# EAGLE design Display-Board_Rack-PDU_2.0 (EAGLE 9.2.1)
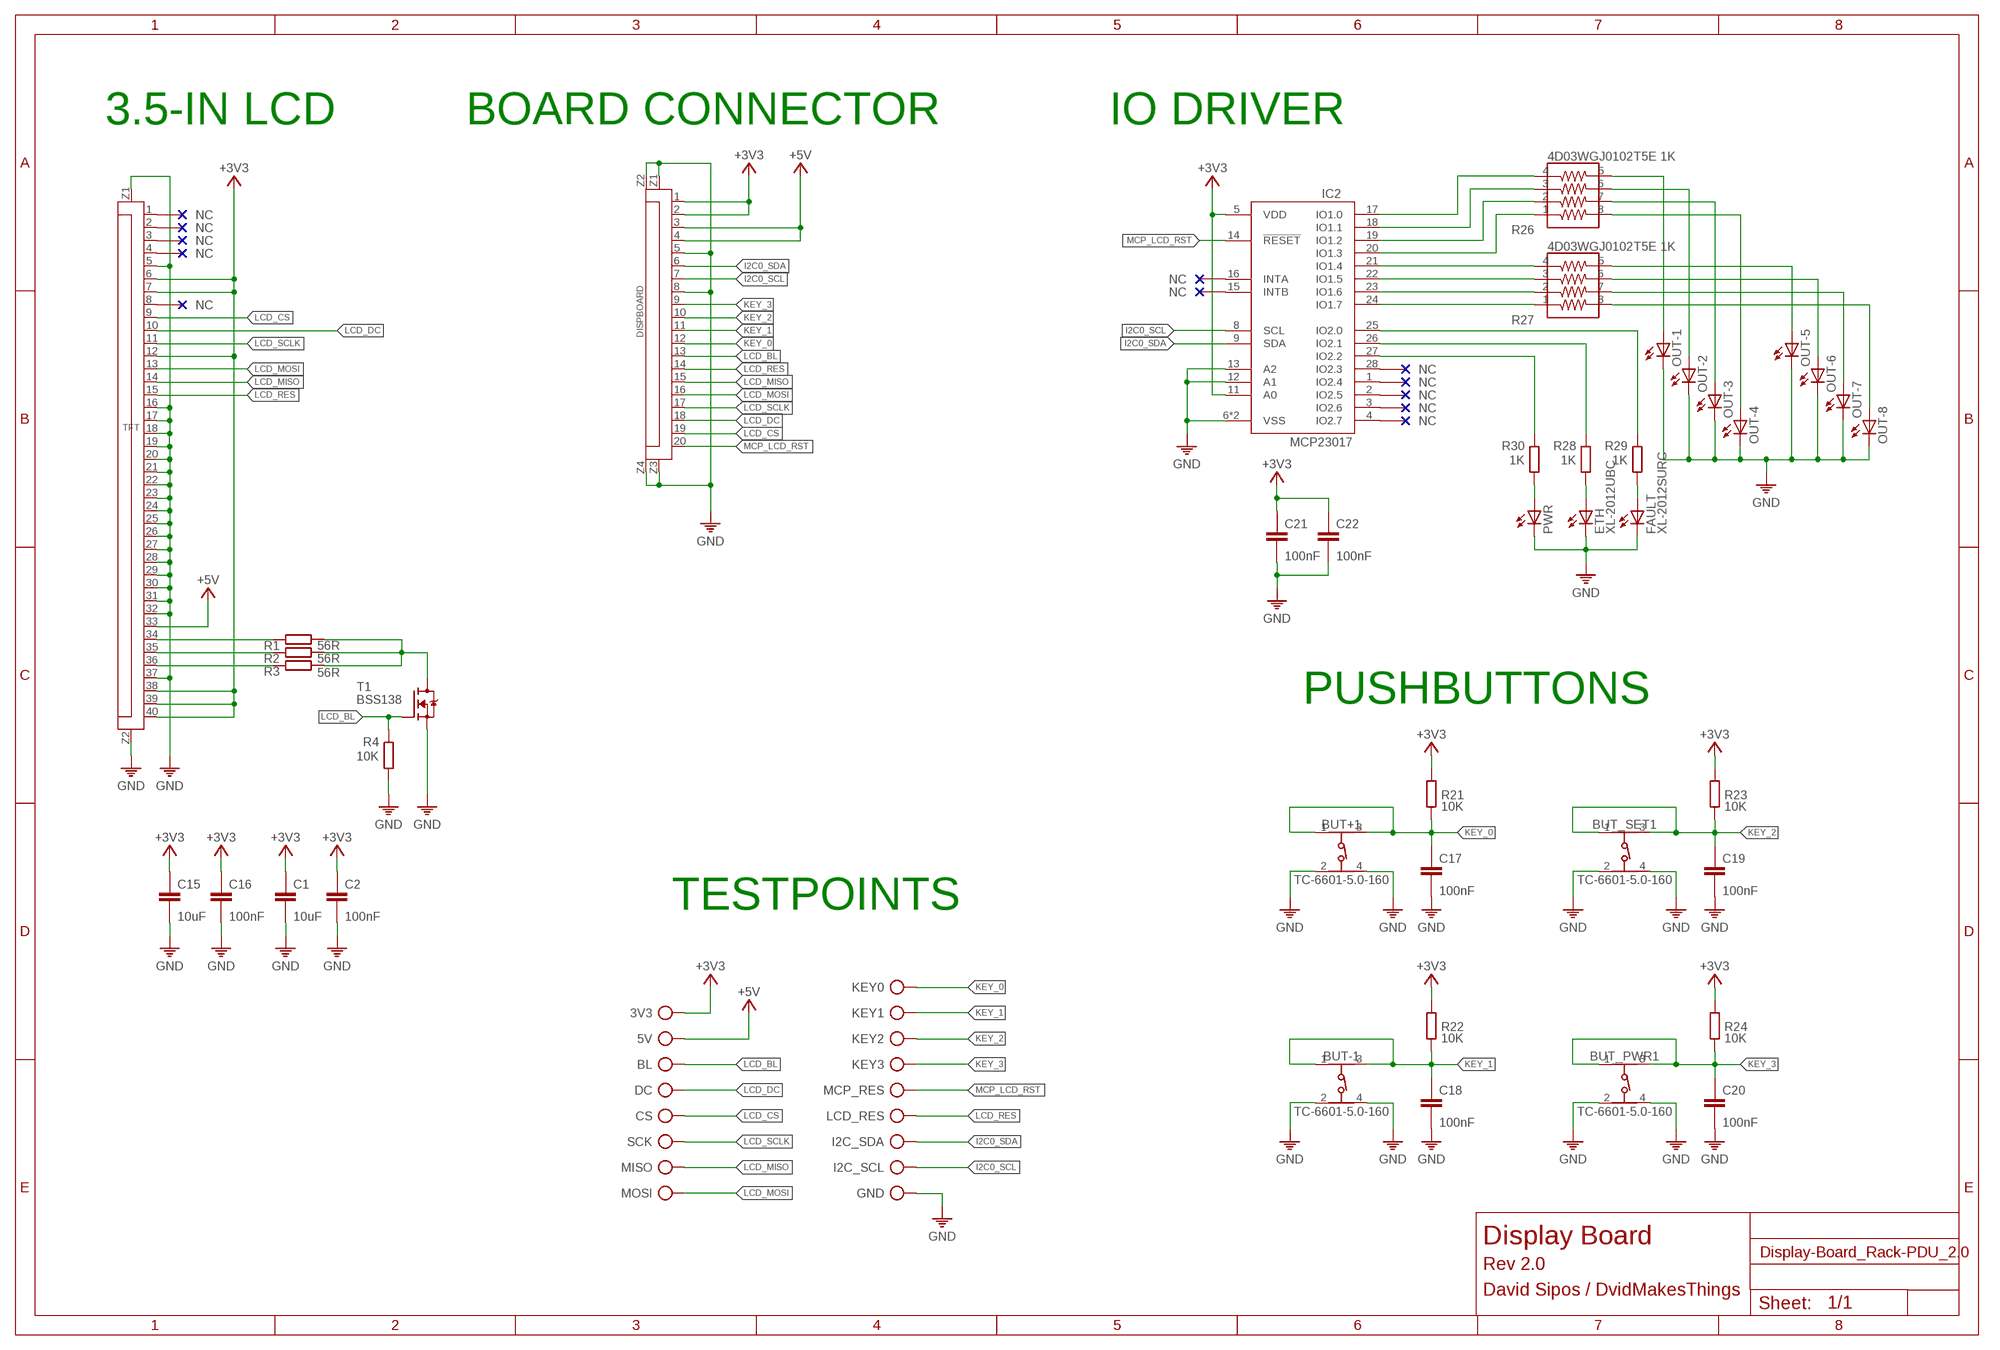
[diagram p0: schematic, sheet 1]

## Parts
3V3  TP  [TP]
5V  TP  [TP]
BL  TP  [TP]
BUT+1  TC-6601-5.0-160  430182043816  [430182043816]
BUT-1  TC-6601-5.0-160  430182043816  [430182043816]
BUT_PWR1  TC-6601-5.0-160  430182043816  [430182043816]
BUT_SET1  TC-6601-5.0-160  430182043816  [430182043816]
C1  10uF  C-0402  [C0402]
C2  100nF  C-0402  [C0402]
C15  10uF  C-0402  [C0402]
C16  100nF  C-0402  [C0402]
C17  100nF  C-0402  [C0402]
C18  100nF  C-0402  [C0402]
C19  100nF  C-0402  [C0402]
C20  100nF  C-0402  [C0402]
C21  100nF  C-0402  [C0402]
C22  100nF  C-0402  [C0402]
CS  TP  [TP]
DC  TP  [TP]
DISPBOARD  FPC20-H  [FPC20]
ETH  XL-2012UBC  LEDCHIP-LED0805  [CHIP-LED0805]
FAULT  XL-2012SURC  LEDCHIP-LED0805  [CHIP-LED0805]
GND  TP  [TP]
I2C_SCL  TP  [TP]
I2C_SDA  TP  [TP]
IC2  MCP23017-E/ML  [QFN28[6X6]ML]
KEY0  TP  [TP]
KEY1  TP  [TP]
KEY2  TP  [TP]
KEY3  TP  [TP]
LCD_RES  TP  [TP]
MCP_RES  TP  [TP]
MISO  TP  [TP]
MOSI  TP  [TP]
OUT-1  LEDCHIP-LED0805  [CHIP-LED0805]
OUT-2  LEDCHIP-LED0805  [CHIP-LED0805]
OUT-3  LEDCHIP-LED0805  [CHIP-LED0805]
OUT-4  LEDCHIP-LED0805  [CHIP-LED0805]
OUT-5  LEDCHIP-LED0805  [CHIP-LED0805]
OUT-6  LEDCHIP-LED0805  [CHIP-LED0805]
OUT-7  LEDCHIP-LED0805  [CHIP-LED0805]
OUT-8  LEDCHIP-LED0805  [CHIP-LED0805]
PWR  LEDCHIP-LED0805  [CHIP-LED0805]
R1  56R  R0402  [0402]
R2  56R  R0402  [0402]
R3  56R  R0402  [0402]
R4  10K  R0402  [0402]
R21  10K  R0402  [0402]
R22  10K  R0402  [0402]
R23  10K  R0402  [0402]
R24  10K  R0402  [0402]
R26  4D03WGJ0102T5E 1K  742C083103JP  [742C083103JP]
R27  4D03WGJ0102T5E 1K  742C083103JP  [742C083103JP]
R28  1K  R0402  [0402]
R29  1K  R0402  [0402]
R30  1K  R0402  [0402]
SCK  TP  [TP]
T1  BSS138  [SOT23]
TFT  FPC40-HD  [FPC40_3.5TFT]

## Nets
+3V3: 3V3.TP C1.1 C2.1 C15.1 C16.1 C21.1 C22.1 DISPBOARD.1 DISPBOARD.2 IC2.5(VDD) IC2.11(A0) R21.1 R22.1 R23.1 R24.1 TFT.6 TFT.7 TFT.12 TFT.38 TFT.39 TFT.40
+5V: 5V.TP DISPBOARD.3 DISPBOARD.4 TFT.33
GND: BUT+1.2 BUT+1.4 BUT-1.2 BUT-1.4 BUT_PWR1.2 BUT_PWR1.4 BUT_SET1.2 BUT_SET1.4 C1.2 C2.2 C15.2 C16.2 C17.2 C18.2 C19.2 C20.2 C21.2 C22.2 DISPBOARD.5 DISPBOARD.8 DISPBOARD.Z1 DISPBOARD.Z2 DISPBOARD.Z3 DISPBOARD.Z4 ETH.C FAULT.C GND.TP IC2.6(VSS) IC2.12(A1) IC2.13(A2) IC2.PAD(VSS) OUT-1.C OUT-2.C OUT-3.C OUT-4.C OUT-5.C OUT-6.C OUT-7.C OUT-8.C PWR.C R4.2 T1.2(S) TFT.5 TFT.16 TFT.17 TFT.18 TFT.19 TFT.20 TFT.21 TFT.22 TFT.23 TFT.24 TFT.25 TFT.26 TFT.27 TFT.28 TFT.29 TFT.30 TFT.31 TFT.32 TFT.37 TFT.Z1 TFT.Z2
I2C0_SCL: DISPBOARD.7 I2C_SCL.TP IC2.8(SCL)
I2C0_SDA: DISPBOARD.6 I2C_SDA.TP IC2.9(SDA)
KEY_0: BUT+1.1 BUT+1.3 C17.1 DISPBOARD.12 KEY0.TP R21.2
KEY_1: BUT-1.1 BUT-1.3 C18.1 DISPBOARD.11 KEY1.TP R22.2
KEY_2: BUT_SET1.1 BUT_SET1.3 C19.1 DISPBOARD.10 KEY2.TP R23.2
KEY_3: BUT_PWR1.1 BUT_PWR1.3 C20.1 DISPBOARD.9 KEY3.TP R24.2
LCD_BL: BL.TP DISPBOARD.13 R4.1 T1.1(G)
LCD_CS: CS.TP DISPBOARD.19 TFT.9
LCD_DC: DC.TP DISPBOARD.18 TFT.10
LCD_MISO: DISPBOARD.15 MISO.TP TFT.14
LCD_MOSI: DISPBOARD.16 MOSI.TP TFT.13
LCD_RES: DISPBOARD.14 LCD_RES.TP TFT.15
LCD_SCLK: DISPBOARD.17 SCK.TP TFT.11
MCP_LCD_RST: DISPBOARD.20 IC2.14(!RESET) MCP_RES.TP
N$2: R2.2 TFT.35
N$3: R3.2 TFT.36
N$4: R1.1 R2.1 R3.1 T1.3(D)
N$5: R1.2 TFT.34
N$46: IC2.26(IO2.1) R28.1
N$47: IC2.27(IO2.2) R30.1
N$48: IC2.25(IO2.0) R29.1
N$50: IC2.17(IO1.0) R26.4
N$51: IC2.18(IO1.1) R26.3
N$52: IC2.19(IO1.2) R26.2
N$53: IC2.20(IO1.3) R26.1
N$54: IC2.21(IO1.4) R27.4
N$55: IC2.22(IO1.5) R27.3
N$56: IC2.23(IO1.6) R27.2
N$57: IC2.24(IO1.7) R27.1
N$58: OUT-1.A R26.5
N$59: OUT-2.A R26.6
N$60: OUT-3.A R26.7
N$61: OUT-4.A R26.8
N$62: OUT-5.A R27.5
N$63: OUT-6.A R27.6
N$64: OUT-7.A R27.7
N$65: OUT-8.A R27.8
N$66: FAULT.A R29.2
N$67: ETH.A R28.2
N$68: PWR.A R30.2
Unconnected: IC2.1(IO2.4) IC2.2(IO2.5) IC2.3(IO2.6) IC2.4(IO2.7) IC2.15(INTB) IC2.16(INTA) IC2.28(IO2.3) TFT.1 TFT.2 TFT.3 TFT.4 TFT.8

## Notes on the sheet
- 3.5-IN LCD | BOARD CONNECTOR | IO DRIVER
- PUSHBUTTONS
- TESTPOINTS
- Display Board
- Rev 2.0
- David Sipos / DvidMakesThings

## Library data of the parts
3V3 5V BL CS DC GND I2C_SCL I2C_SDA KEY0 KEY1-KEY3 LCD_RES MCP_RES MISO MOSI SCK = ds_passive:TP
BUT+1 BUT-1 BUT_PWR1 BUT_SET1 = Wurth_Switch_WS-TASV:430182043816: WS-TASV SMT Tact Switch 6x6 mm Material Properties Cover Material : Stainless Steel Properties Actuator Material:LCP Actuator Flammability :UL94 V-0 Rating Actuator Color:Black; Salmon; White Frame Material:LCP Flammability Rating:UL94 V-0 Frame Color:Black Contact Material:Stainless Steel Contact Plating:Silver Terminal Material:Copper Alloy Terminal Plating:Silver VR:12 V (DC) Contact Resistance Initial:100 mΩ Contact Resistance After Life Test:2Ω RISO:100 MΩ Withstanding Voltage:250 V (AC) Washable:No Qty.:4000;5000 Mechanical Properties Electrical Life:400; 550; 1000 Stroke :0.25 mm General Information Operating Temperature:-40 up to +85 °C Washable:No Packaging Properties Packaging:Tape and Reel <https://www.we-online.com/catalog/media/o37470v209%20Family_WS-TASV_6x6mm_SMD_Tact_Switch_4301820xx8xx.jpg> Details see: https://www.we-online.com/catalog/en/TASV_6X6_SMD/ Updated by yingchun,Shan;2020-02-18 2020(C) Würth Elektronik; DATASHEET-URL: https://www.we-online.com/redexpert/spec/430182043816?ae; HEIGHT: 4.3mm; OPERATION-FORCE: 160g; PART-NUMBER: 430182043816; QTY: 1000; VALUE: 430182043816
C1 C2 C15-C22 = ds_passive:C
DISPBOARD = ds_con:FPC20-H
ETH FAULT OUT-1-OUT-8 PWR = led:LED: LED OSRAM: - CHIPLED LG R971, LG N971, LY N971, LG Q971, LY Q971, LO R971, LY R971 LH N974, LH R974 LS Q976, LO Q976, LY Q976 LO Q996 - Hyper CHIPLED LW Q18S LB Q993, LB Q99A, LB R99A - SideLED LS A670, LO A670, LY A670, LG A670, LP A670 LB A673, LV A673, LT A673, LW A673 LH A674 LY A675 LS A676, LA A676, LO A676, LY A676, LW A676 LS A679, LY A679, LG A679 - Hyper Micro SIDELED® LS Y876, LA Y876, LO Y876, LY Y876 LT Y87S - SmartLED LW L88C, LW L88S LB L89C, LB L89S, LG L890 LS L89K, LO L89K, LY L89K LS L896, LA L896, LO L896, LY L896 - TOPLED LS T670, LO T670, LY T670, LG T670, LP T670 LSG T670, LSP T670, LSY T670, LOP T670, LYG T670 LG T671, LOG T671, LSG T671 LB T673, LV T673, LT T673, LW T673 LH T674 LS T676, LA T676, LO T676, LY T676, LB T676, LH T676, LSB T676, LW T676 LB T67C, LV T67C, LT T67C, LS T67K, LO T67K, LY T67K, LW E67C LS E67B, LA E67B, LO E67B, LY E67B, LB E67C, LV E67C, LT E67C LW T67C LS T679, LY T679, LG T679 LS T770, LO T770, LY T770, LG T770, LP T770 LB T773, LV T773, LT T773, LW T773 LH T774 LS E675, LA E675, LY E675, LS T675 LS T776, LA T776, LO T776, LY T776, LB T776 LHGB T686 LT T68C, LB T68C - Hyper Mini TOPLED® LB M676 - Mini TOPLED Santana® LG M470 LS M47K, LO M47K, LY M47K Source: http://www.osram.convergy.de LUXEON: - LUMILED® LXK2-PW12-R00, LXK2-PW12-S00, LXK2-PW14-U00, LXK2-PW14-V00 LXK2-PM12-R00, LXK2-PM12-S00, LXK2-PM14-U00 LXK2-PE12-Q00, LXK2-PE12-R00, LXK2-PE12-S00, LXK2-PE14-T00, LXK2-PE14-U00 LXK2-PB12-K00, LXK2-PB12-L00, LXK2-PB12-M00, LXK2-PB14-N00, LXK2-PB14-P00, LXK2-PB14-Q00 LXK2-PR12-L00, LXK2-PR12-M00, LXK2-PR14-Q00, LXK2-PR14-R00 LXK2-PD12-Q00, LXK2-PD12-R00, LXK2-PD12-S00 LXK2-PH12-R00, LXK2-PH12-S00 LXK2-PL12-P00, LXK2-PL12-Q00, LXK2-PL12-R00 Source: www.luxeon.com KINGBRIGHT: KA-3528ASYC Source: www.kingbright.com
IC2 = ds_ic_peripherals:MCP23017: 16-Bit I2C I/O Expander with Serial Interface
R1-R4 R21-R24 R28-R30 = ds_passive:R
R26 R27 = Resistor Array:742C083103JP: RES ARRAY 4 RES 10K OHM 1206 Manufacturer's datasheet <https://www.ctscorp.com/wp-content/uploads/74x.pdf>; CREATED_BY: PCBLayout.com; DIGIKEY_PN: 742C083103JPTR-ND; MANUFACTURER: CTS Resistor Products; MPN: 742C083103JP; PACKAGE: 1206
T1 = transistor-fet:BSS138: N-Channel Logic Level Enhancement Mode Field Effect Transistor
TFT = ds_con:FPC40-H

## Net classes
0 default: width 0.2 mm, drill 0.35 mm, clearance 0.191 mm

## Board
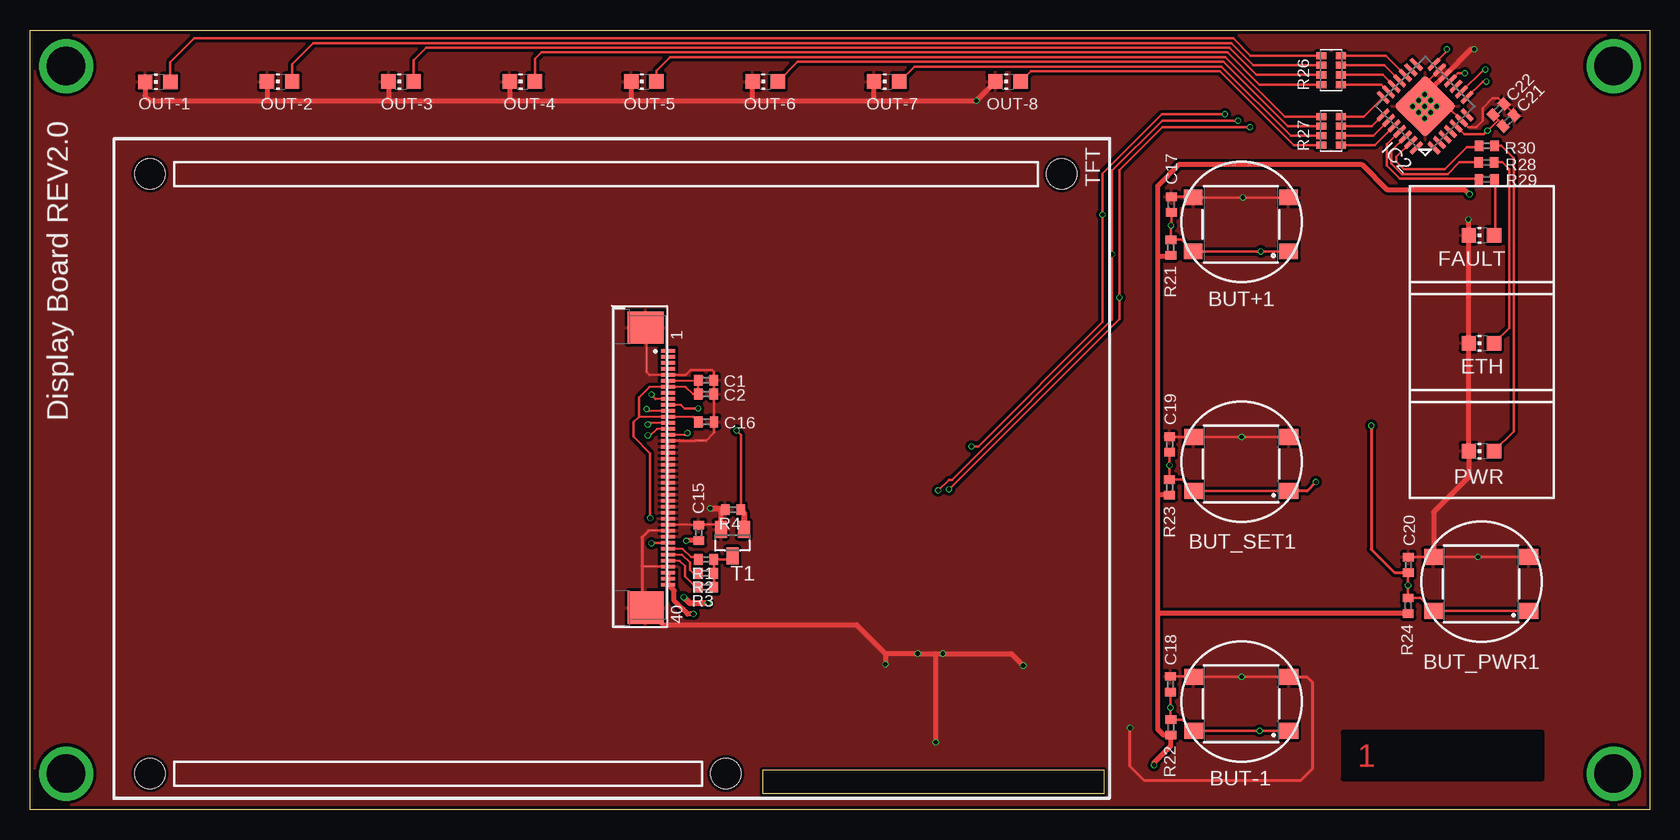
[diagram p1: board, top side]
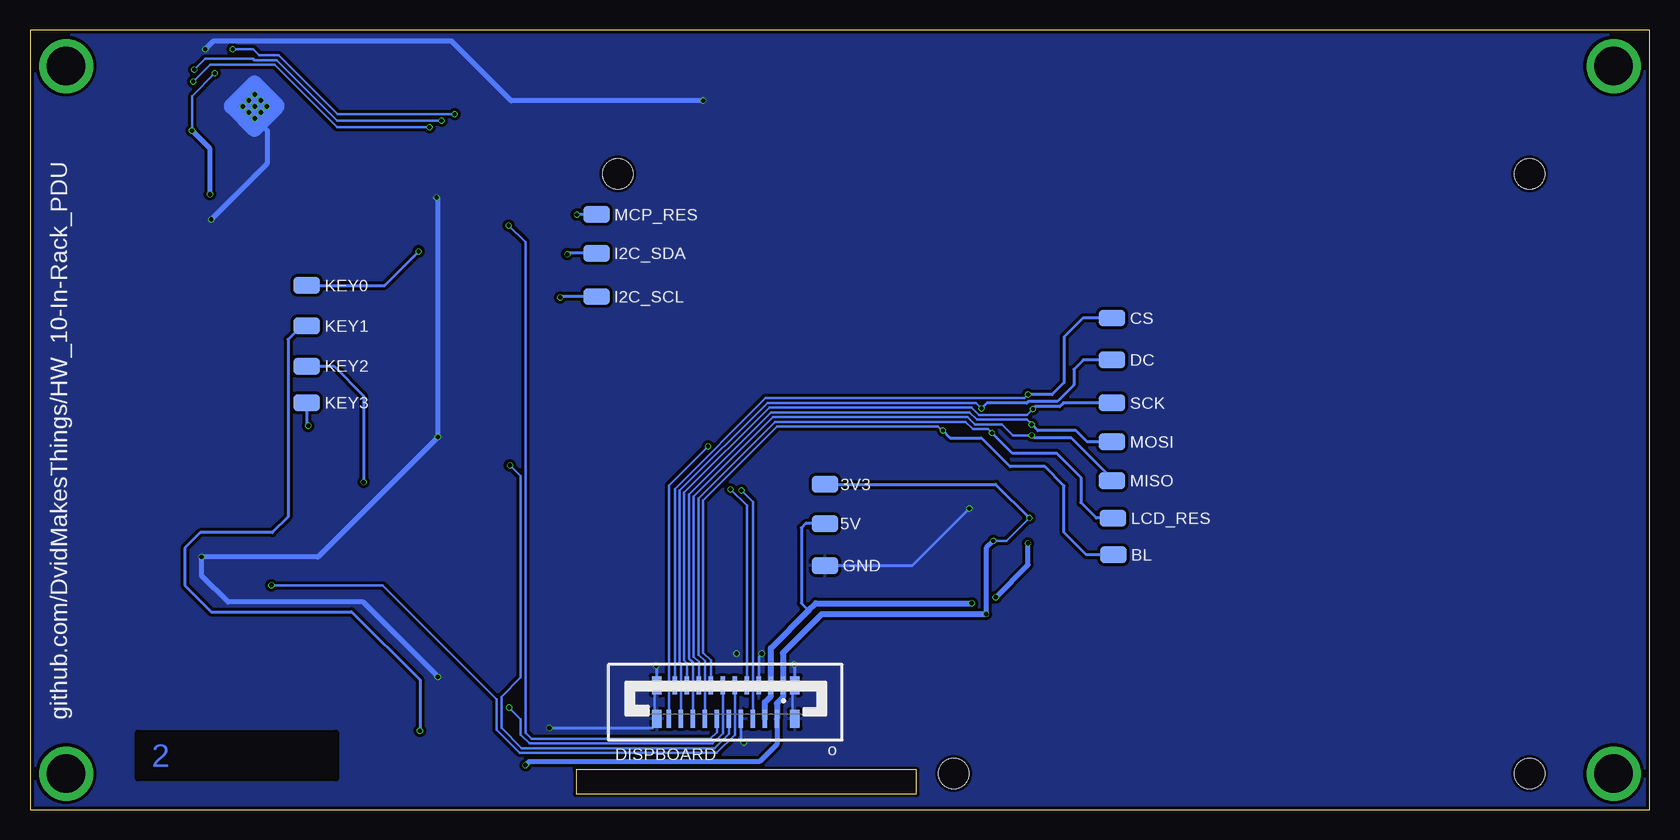
[diagram p2: board, bottom side, seen from below]

Size 135 x 65 mm. Coordinates in mm from the lower left corner, seen from the top.
Outline: 0,0 0,65 135,65 135,0 0,0
Outline: 61.1,3.3 89.5,3.3 89.5,1.3 61.1,1.3 61.1,3.3
Copper layers (1*16): Top 0.035mm / dielectric 1.6mm / Bottom 0.035mm
Design rules "jlcpcb-2layers": minimum track width 5mil, minimum drill 0.3mm, track to track 5mil, track to pad 5mil, pad to pad 5mil, via to via 5mil, smd to smd 5mil, copper to edge 0.2mm, drill to drill 6mil, minimum pad ring 10mil, minimum via ring 3mil, stop-mask expansion 4mil, vias tented up to drill 0mil, thermal gap 10mil
Holes 2.5 mm at 10,53 86,53 10,3 58,3

### Footprints (pad centres in the part's own frame; a part is rotated, then mirrored left to right if it is on the bottom)
TP = smd 2.2 x 1.4: TP 0,0
430182043816 = smd 1.55 x 1.3: 1 -3.975,2.25; 2 -3.975,-2.25; 3 3.975,2.25; 4 3.975,-2.25
C0402 = smd 0.7 x 0.9: 1 -0.65,0; 2 0.65,0
FPC20 = smd 0.4 x 1.5: 1 -4.552,-1.362; 2 -4.052,1.438; 3 -3.552,-1.362; 4 -3.052,1.438; 5 -2.552,-1.362; 6 -2.052,1.438; 7 -1.552,-1.362; 8 -1.052,1.438; 9 -0.552,-1.362; 10 -0.052,1.438; 11 0.448,-1.362; 12 0.948,1.438; 13 1.448,-1.362; 14 1.948,1.438; 15 2.448,-1.362; 16 2.948,1.438; 17 3.448,-1.362; 18 3.948,1.438; 19 4.448,-1.362; 20 4.948,1.438 | smd 0.8 x 1.5: Z1 -5.552,-1.362; Z2 -5.552,1.438; Z3 5.948,-1.362; Z4 5.948,1.438
CHIP-LED0805 = smd 1.2 x 1.2: A 0,-1.05; C 0,1.05
QFN28[6X6]ML = smd 1.27 x 0.35: 1 -2.985,1.95; 2 -2.985,1.3; 3 -2.985,0.65; 4 -2.985,0; 5 -2.985,-0.65; 6 -2.985,-1.3; 7 -2.985,-1.95; 15 2.985,-1.95; 16 2.985,-1.3; 17 2.985,-0.65; 18 2.985,0; 19 2.985,0.65; 20 2.985,1.3; 21 2.985,1.95 | smd 0.35 x 1.27: 8 -1.95,-2.985; 9 -1.3,-2.985; 10 -0.65,-2.985; 11 0,-2.985; 12 0.65,-2.985; 13 1.3,-2.985; 14 1.95,-2.985; 22 1.95,2.985; 23 1.3,2.985; 24 0.65,2.985; 25 0,2.985; 26 -0.65,2.985; 27 -1.3,2.985; 28 -1.95,2.985 | smd 3.7 x 3.7: PAD 0,0
0402 = smd 0.7 x 0.9: 1 -0.65,0; 2 0.65,0
742C083103JP = smd 0.59 x 0.92: 1 -1.2,-0.8; 2 -0.4,-0.8; 3 0.4,-0.8; 4 1.2,-0.8; 5 1.2,0.8; 6 0.4,0.8; 7 -0.4,0.8; 8 -1.2,0.8
SOT23 = smd 1 x 1.4: 1 -0.95,-1.1; 2 0.95,-1.1; 3 0,1.1
FPC40_3.5TFT = smd 1.2 x 0.3: 1 24.191,10.261; 2 24.191,9.761; 3 24.191,9.261; 4 24.191,8.761; 5 24.191,8.261; 6 24.191,7.761; 7 24.191,7.261; 8 24.191,6.761; 9 24.191,6.261; 10 24.191,5.761; 11 24.191,5.261; 12 24.191,4.761; 13 24.191,4.261; 14 24.191,3.761; 15 24.191,3.261; 16 24.191,2.761; 17 24.191,2.261; 18 24.191,1.761; 19 24.191,1.261; 20 24.191,0.761; 21 24.191,0.261; 22 24.191,-0.239; 23 24.191,-0.739; 24 24.191,-1.239; 25 24.191,-1.739; 26 24.191,-2.239; 27 24.191,-2.739; 28 24.191,-3.239; 29 24.191,-3.739; 30 24.191,-4.239; 31 24.191,-4.739; 32 24.191,-5.239; 33 24.191,-5.739; 34 24.191,-6.239; 35 24.191,-6.739; 36 24.191,-7.239; 37 24.191,-7.739; 38 24.191,-8.239; 39 24.191,-8.739; 40 24.191,-9.239 | smd 3 x 2.7: Z1 22.331,12.191; Z2 22.331,-11.169

### Placement (x,y rotation side)
3V3  68.74,27.12 0 bottom
5V  68.74,23.85 0 bottom
BL  44.7,21.25 0 bottom
BUT+1  100.94,48.79 180 top
BUT-1  100.96,8.81 180 top
BUT_PWR1  120.96,18.81 180 top
BUT_SET1  100.96,28.81 180 top
C1  56.35,35.8 0 top
C2  56.35,34.65 0 top
C15  55.75,23.07 90 top
C16  56.37,32.32 0 top
C17  95.14,50.44 90 top
C18  95.06,10.46 90 top
C19  95,30.44 90 top
C20  114.9,20.41 90 top
C21  123.26,57.44 45 top
C22  122.42,58.37 45 top
CS  44.8,40.98 0 bottom
DC  44.8,37.5 0 bottom
DISPBOARD  76.8,9 180 bottom
ETH  120.99,38.88 90 top
FAULT  120.99,47.88 90 top
GND  68.74,20.35 0 bottom
I2C_SCL  87.79,42.77 0 bottom
I2C_SDA  87.79,46.39 0 bottom
IC2  116.29,58.65 135 top
KEY0  111.92,43.7 0 bottom
KEY1  111.92,40.33 0 bottom
KEY2  111.92,36.96 0 bottom
KEY3  111.92,33.93 0 bottom
LCD_RES  44.71,24.3 0 bottom
MCP_RES  87.79,49.61 0 bottom
MISO  44.8,27.43 0 bottom
MOSI  44.8,30.66 0 bottom
OUT-1  10.65,60.68 90 top
OUT-2  20.81,60.7 90 top
OUT-3  30.93,60.7 90 top
OUT-4  41.05,60.7 90 top
OUT-5  51.17,60.7 90 top
OUT-6  61.29,60.7 90 top
OUT-7  71.41,60.7 90 top
OUT-8  81.53,60.7 90 top
PWR  120.99,29.88 90 top
R1  56.35,20.85 180 top
R2  56.35,19.7 180 top
R3  56.35,18.55 180 top
R4  58.6,25 180 top
R21  95.1,46.86 90 top
R22  95.1,6.84 90 top
R23  94.99,26.86 90 top
R24  114.87,16.99 90 top
R26  108.46,61.65 90 top
R27  108.46,56.59 90 top
R28  121.4,53.96 0 top
R29  121.42,52.55 0 top
R30  121.44,55.34 0 top
SCK  44.8,33.9 0 bottom
T1  58.55,22.25 180 top
TFT  29,28 0 top
U$1  [2-LAYER]  109.5,2.6 0 top

### Tracks (layer width: path | path; a pad name or v marks a point on that pad's centre or on a via)
+3V3  (via drill 0.35 pad 0.45)
  Top 0.203: C1.1 | C1.1 C2.1 55.25,34.65 54.65,35.25 TFT.7 | C15.1 55.75,22.29 | C16.1 55.3,32.75 55.25,32.75 TFT.12 50.75,32.75 | TFT.7 TFT.6 55.65,35.75 C1.1 | v51.7,24.3 51.7,29.7 50.3,31.1 50.3,32.3 50.75,32.75 | TFT.7 51.65,35.25 50.75,34.35 50.75,32.75 | IC2.5 119.57,56.3 121.2,56.3 v121.5,56.6 122.4,57.5 | 122.4,57.5 122.8,57.1 C21.1 | C22.1 121.99,57.91 122.4,57.5 | IC2.11 119.04,61.4 v119.6,61.4
  Top 0.254: 53.19,19.6 TFT.38
  Top 0.406: 94,16.5 94,6.7 94.51,6.19 R22.1 95.1,5.3 93.7,3.9 v93.7,3.7 | 94,16.5 94,26.1 | 94,26.1 94,46.1 | 94,46.1 94,52 95.8,53.8 111,53.8 113.1,51.7 119.6,51.7 v120,51.3 | R21.1 94.98,46.1 94,46.1 | R23.1 94.11,26.21 94,26.1 | R24.1 94.16,16.34 94,16.5 | v55.3,16.3 54.8,16.3 53.7,17.4 53.7,18.25 TFT.40 TFT.39 53.19,19.6 | C15.1 54.72,22.42 v54.7,22.4
  Bottom 0.203: v51.7,24.3 53.6,22.4 v54.7,22.4 | v119.6,61.4 121.5,59.5 v121.5,56.6
  Bottom 0.254: 3V3.TP 54.52,27.12 v51.7,24.3
  Bottom 0.406: v54.7,22.4 55.3,21.8 v55.3,16.3 | v120,51.3 120,55.1 v121.5,56.6 | v93.7,3.7 93.4,4 74.2,4 72.75,5.45 DISPBOARD.2
  Bottom 0.508: v55.3,16.3 69,16.3 72.25,13.05 DISPBOARD.1 72.25,9.35 72.75,8.85 DISPBOARD.2
+5V  (via drill 0.35 pad 0.45)
  Top 0.254: v51.8,22.2 51.85,22.25 TFT.33
  Top 0.508: v56.5,17.2 55,17.2 v54.5,17.7
  Bottom 0.254: 5V.TP 70.35,23.85 70.7,23.5 70.7,17.2 70.1,16.6
  Bottom 0.406: v54.5,17.7 51.8,20.4 v51.8,22.2
  Bottom 0.508: v56.5,17.2 69.5,17.2 70.1,16.6 73.25,13.45 DISPBOARD.3 73.25,9.45 73.75,8.95 DISPBOARD.4
GND  (via drill 0.35 pad 0.45)
  Top 0.2: BUT-1.2 v101,11.06 BUT-1.4 96.94,11.11 C18.2 | C17.2 96.92,51.09 BUT+1.4 v101.1,51.04 | BUT+1.2 101.2,51.04 | BUT_SET1.2 v101,31.06 BUT_SET1.4 95.02,31.06 C19.2 | C20.2 BUT_PWR1.4 117.1,21.06 v120.7,21.06 BUT_PWR1.2 | 54.65,36.25 TFT.5 | 56.35,30.75 56.35,30.76 55.47,30.76 55.47,30.73 54.13,30.73 54.13,30.76 TFT.16 | TFT.20 TFT.19 TFT.18
  Top 0.203: 57,34.95 C2.2 57,32.34 C16.2 57.02,31.42 56.35,30.75 | 57,34.95 C1.2 57,36.5 56.85,36.65 55.05,36.65 54.65,36.25 | 57.02,34.93 57,34.95 | 55.68,23.79 C15.2 | 55.68,23.79 57.16,23.79 T1.2 | TFT.30 55.64,23.75 55.68,23.79 | TFT.32 TFT.31 TFT.30 | TFT.30 TFT.29 TFT.28 TFT.27 TFT.26 TFT.25 TFT.24 TFT.23 TFT.22 TFT.21 TFT.20 | 116.77,59.12 v116.75,59.12 | IC2.12 116.66,59.94 116.3,59.57 IC2.PAD | IC2.13 115.75,59.95 v115.75,59.12 | v117.25,58.62 118.16,58.62 IC2.6 119.89,56.9 120.54,56.9 121.1,57.46 121.1,58.5 121.9,59.3 122.41,59.3 C22.2 123.72,58 C21.2 | TFT.18 TFT.17 TFT.16 | TFT.5 51.65,36.25 51.4,36.5 51.4,40.17 TFT.Z1
  Top 0.254: TFT.37 51.05,20.25 51,20.3 | 51,20.3 51,17.21 TFT.Z2 | TFT.31 51.55,23.25 51,22.7 51,20.3 | IC2.13 117.93,61.24 117.96,61.24 | BUT-1.2 106.44,11.06 106.9,10.6 106.9,3.4 105.9,2.4 92.9,2.4 91.7,3.6 v91.7,6.8
  Top 0.406: 117.1,21.06 117,21.16 117,24.8 119.94,27.74 PWR.C ETH.C FAULT.C 119.94,49.16 v119.9,49.2 | OUT-1.C 9.6,59.5 10,59.1 19.8,59.1 | 19.8,59.1 29.7,59.1 | 29.7,59.1 40.2,59.1 | 40.2,59.1 50.2,59.1 | 50.2,59.1 60.2,59.1 | 60.2,59.1 70.3,59.1 | 70.3,59.1 v78.88,59.1 OUT-8.C | OUT-7.C 70.3,60.64 70.3,59.1 | OUT-6.C 60.2,60.66 60.2,59.1 | OUT-5.C 50.12,59.18 50.2,59.1 | OUT-4.C 40,59.3 40.2,59.1 | OUT-3.C 29.88,59.28 29.7,59.1 | OUT-2.C 19.76,59.14 19.8,59.1 | 101.2,51.04 v101.1,51.04 | T1.2 57.6,24.95 57.45,25.1 v56.7,25.1 | v120.4,63.4 120.12,63.4 117.96,61.24 116.66,59.94 | TFT.Z2 52.81,15.4 68.9,15.4 71.3,13 | 71.3,13 v71.3,12.1 | 71.3,13 v74,13 75.5,13 | 75.5,13 v76.1,13 81.8,13 v82.8,12 | v75.5,5.6 75.5,13
  Top 0.508: v56.7,25.1 57.85,25.1 R4.2
  Bottom 0.203: v116.25,59.62 v115.75,59.12 v115.25,58.62 v115.75,58.12 v116.25,58.62 v116.75,59.12 117.09,58.79 | v116.25,57.62 v116.75,58.12 v117.25,58.62 117.83,59.2 | v74,13 74.25,12.75 DISPBOARD.5 | 82.75,11.95 v82.8,12 | 82.95,7.56 82.95,10.36 | 71.45,7.56 71.45,10.36 | 71.25,12.05 v71.3,12.1 | v75.5,5.6 75.75,5.85 DISPBOARD.8
  Bottom 0.254: GND.TP 61.45,20.35 v56.7,25.1 | DISPBOARD.Z4 82.75,7.15 83.1,6.8 v91.7,6.8 | DISPBOARD.Z3 82.75,11.95 v82.8,12 | DISPBOARD.Z1 71.25,12.05
  Bottom 0.406: v119.9,49.2 115.2,53.9 115.2,56.57 v116.25,57.62 | v78.88,59.1 94.89,59.1 99.86,64.08 119.72,64.08 v120.4,63.4 | v101.1,51.04 101,50.94 v101,31.06 111,21.06 v120.7,21.06 120.7,19.5 118.5,17.3 107.24,17.3 v101,11.06
  Bottom 1.27: 116.3,58.67 116.3,60.6 114.4,58.7 114.4,58.6 116.3,56.7 118.2,58.6 118.2,58.7 116.4,60.5 115.4,59.5 115.4,59.48 v116.25,58.62 116.3,58.67 | 116.3,58.67 116.3,57.67 v116.25,57.62 116.25,57.95 117.09,58.79 v117.25,58.62
  pour Bottom (isolate 0.254): -12.8,71.02 137.7,71.02 137.7,-4.78 -12.8,-4.78
  pour Top (isolate 0.254): -13.5,69.22 137.15,69.22 137.15,-4.18 -13.5,-4.18
I2C0_SCL  (via drill 0.35 pad 0.45)
  Top 0.203: v76.6,26.7 90.8,40.9 v90.8,42.7 90.8,53.3 94.4,56.9 v101.7,56.9 | v121.4,60.7 121.1,60.7 IC2.8
  Bottom 0.203: v76.6,26.7 75.25,25.35 DISPBOARD.7 | v101.7,56.9 109.4,56.9 114.6,62.1 120,62.1 v121.4,60.7
  Bottom 0.254: I2C_SCL.TP 90.73,42.77 v90.8,42.7
I2C0_SDA  (via drill 0.35 pad 0.45)
  Top 0.203: v75.7,26.6 76.6,27.5 76.84,27.5 90.21,40.86 v90.21,46.3 90.21,53.26 94.39,57.44 v100.7,57.44 | v121.3,61.7 121.18,61.7 IC2.9
  Bottom 0.203: v100.7,57.44 109.39,57.44 114.44,62.49 116.29,62.49 116.4,62.6 120.4,62.6 v121.3,61.7 | DISPBOARD.6 74.75,25.65 v75.7,26.6
  Bottom 0.254: I2C_SDA.TP 90.12,46.39 v90.21,46.3
KEY_0  (via drill 0.35 pad 0.45)
  Top 0.203: C17.1 95.14,48.74 v95.1,48.7 R21.2 95.99,47.51 BUT+1.3 v102.6,46.54 BUT+1.1
  Bottom 0.203: v95.1,48.7 93.7,47.3 93.7,6.4 93.2,5.9 78.3,5.9 77.75,6.45 DISPBOARD.12
  Bottom 0.254: KEY0.TP 105.44,43.7 v102.6,46.54
KEY_1  (via drill 0.35 pad 0.45)
  Top 0.203: C18.1 v95.06,8.5 95.06,7.53 R22.2 96.05,7.49 BUT-1.3 v102.5,6.56 BUT-1.1
  Bottom 0.203: v95.06,8.5 94.09,7.53 94.09,6.24 93.36,5.51 78.09,5.51 77.25,6.35 DISPBOARD.11
  Bottom 0.254: KEY1.TP 112.37,40.33 113.5,39.2 113.5,24.4 114.8,23.1 120.8,23.1 122.1,21.8 122.1,18.7 119.9,16.5 108.2,16.5 102.5,10.8 v102.5,6.56
KEY_2  (via drill 0.35 pad 0.45)
  Top 0.203: BUT_SET1.1 104.8,26.56 BUT_SET1.3 96.03,27.51 R23.2 v95,28.7 C19.1
  Top 0.254: v107.2,27.3 106.46,26.56 104.8,26.56
  Bottom 0.203: v95,28.7 94.09,27.8 94.09,11.01 95.7,9.4 95.7,6.8 94.01,5.11 77.93,5.11 76.75,6.29 DISPBOARD.10
  Bottom 0.254: KEY2.TP 109.66,36.96 107.2,34.5 v107.2,27.3
KEY_3  (via drill 0.35 pad 0.45)
  Top 0.2: BUT_PWR1.1 BUT_PWR1.3 115.9,17.64 R24.2 v114.87,18.7 114.87,19.73 C20.1
  Top 0.254: v111.8,32 111.8,21.7 113.74,19.76 C20.1
  Bottom 0.203: v114.87,18.7 105.59,18.7 96.09,9.2 96.09,6.64 94.18,4.72 77.77,4.72 76.25,6.24 DISPBOARD.9
  Bottom 0.254: KEY3.TP 111.92,32.12 v111.8,32
LCD_BL  (via drill 0.35 pad 0.45)
  Top 0.203: v58.9,31.6 59.25,31.25 R4.1
  Top 0.508: R4.1 59.5,24.75 T1.1
  Bottom 0.203: v58.9,31.6 58.96,31.6 59.3,31.94 72.72,31.94 78.89,25.77 78.89,13.07 78.25,12.43 DISPBOARD.13
  Bottom 0.254: BL.TP 46.95,21.25 48.8,23.1 48.8,27 50.4,28.6 53.3,28.6 55.7,31 58.3,31 v58.9,31.6
LCD_CS  (via drill 0.35 pad 0.45)
  Top 0.203: v51.8,34.6 52.15,34.25 TFT.9
  Bottom 0.203: v51.8,34.6 52.1,34.3 73.7,34.3 81.25,26.75 81.25,12.09 DISPBOARD.19
  Bottom 0.254: CS.TP 47.22,40.98 48.8,39.4 48.8,35.6 49.8,34.6 v51.8,34.6
LCD_DC  (via drill 0.35 pad 0.45)
  Top 0.203: v55.68,33.45 54.55,33.45 54.25,33.75 TFT.10
  Bottom 0.203: v55.68,33.45 56.14,33.91 73.54,33.91 80.86,26.59 80.86,12.26 80.75,12.15 DISPBOARD.18
  Bottom 0.254: DC.TP 47.2,37.5 48,36.7 48,35.4 49.37,34.03 51.78,34.03 51.93,33.88 55.25,33.88 v55.68,33.45
LCD_MISO  (via drill 0.35 pad 0.45)
  Top 0.203: v51.5,31.2 51.7,31.2 52.25,31.75 TFT.14
  Bottom 0.203: v51.5,31.2 53.08,31.2 54,32.12 56.23,32.12 56.84,32.73 73.05,32.73 79.67,26.1 79.67,12.75 79.25,12.32 DISPBOARD.15
  Bottom 0.254: MISO.TP 44.8,27.6 48.2,31 51.3,31 v51.5,31.2
LCD_MOSI  (via drill 0.35 pad 0.45)
  Top 0.2: TFT.13 51.65,32.25 v51.5,32.1
  Bottom 0.203: v51.5,32.1 51.91,32.51 56.07,32.51 56.67,33.12 73.21,33.12 80.07,26.26 80.07,12.58 79.75,12.26 DISPBOARD.16
  Bottom 0.254: MOSI.TP 46.86,30.66 47.8,31.6 51,31.6 v51.5,32.1
LCD_RES  (via drill 0.35 pad 0.45)
  Top 0.203: v54.8,31.4 54.65,31.25 TFT.15
  Bottom 0.203: v54.8,31.4 55.13,31.73 56.39,31.73 57,32.33 72.89,32.33 79.28,25.93 79.28,12.91 78.75,12.38 DISPBOARD.14
  Bottom 0.254: LCD_RES.TP 46.11,24.3 47.41,25.6 47.41,27.7 49.41,29.7 53.1,29.7 v54.8,31.4
LCD_SCLK  (via drill 0.35 pad 0.45)
  Top 0.203: v51.4,33.4 51.55,33.25 TFT.11
  Bottom 0.203: v51.4,33.4 51.89,32.91 55.91,32.91 56.51,33.51 73.37,33.51 80.46,26.42 80.46,12.42 80.25,12.21 DISPBOARD.17
  Bottom 0.254: SCK.TP 48.87,33.9 49.19,33.59 51.21,33.59 v51.4,33.4
MCP_LCD_RST  (via drill 0.35 pad 0.45)
  Top 0.203: v78.48,30.28 79.07,30.28 89.41,40.63 v89.41,49.6 89.41,53.03 94.37,57.99 v99.6,57.99 | v118.1,63.4 118.1,63.22 IC2.14
  Bottom 0.203: v78.48,30.28 81.75,27.02 DISPBOARD.20 | v99.6,57.99 109.37,57.99 114.27,62.89 115.9,62.89 116.41,63.4 v118.1,63.4
  Bottom 0.254: MCP_RES.TP v89.41,49.6
N$2
  Top 0.203: R2.2 55.3,19.7 55,20 55,20.59 54.34,21.25 TFT.35
N$3
  Top 0.203: R3.2 55.5,18.75 55.3,18.75 54.6,19.45 54.6,20.3 54.15,20.75 TFT.36
N$4
  Top 0.203: R3.1 R2.1 R1.1 58.25,20.85 T1.3
N$5
  Top 0.203: R1.2 55.5,21.05 55.1,21.05 54.4,21.75 TFT.34
N$6  (via drill 3.2 pad 4.5)
  other vias: 3,3
N$7  (via drill 3.2 pad 4.5)
  other vias: 132,3
N$8  (via drill 3.2 pad 4.5)
  other vias: 3,62
N$9  (via drill 3.2 pad 4.5)
  other vias: 132,62
N$46
  Top 0.203: R28.1 119.16,53.96 118.19,52.99 114.36,52.99 113.49,53.86 113.49,54.93 IC2.26
N$47
  Top 0.203: IC2.27 113.9,54.42 113.9,54.01 114.53,53.39 117.93,53.39 119.78,55.24 120.69,55.24 R30.1
N$48
  Top 0.203: IC2.25 113.1,55.46 113.1,53.7 114.2,52.6 120.72,52.6 R29.1
N$50
  Top 0.203: R26.4 113.02,62.85 IC2.17
N$51
  Top 0.203: IC2.18 112.9,62.05 R26.3
N$52
  Top 0.203: R26.2 112.78,61.25 IC2.19
N$53
  Top 0.203: IC2.20 112.66,60.45 R26.1
N$54
  Top 0.203: R27.4 111.21,57.79 IC2.21
N$55
  Top 0.203: R27.3 111.87,56.99 IC2.22
N$56
  Top 0.203: R27.2 111.99,56.19 IC2.23
N$57
  Top 0.203: R27.1 112.11,55.39 IC2.24
N$58
  Top 0.2: R26.5 101.75,62.85 100.3,64.3 13.7,64.3 11.7,62.3 OUT-1.A
N$59
  Top 0.2: R26.6 102,62.05 100.14,63.91 23.61,63.91 21.86,62.16 OUT-2.A
N$60
  Top 0.2: R26.7 102.24,61.25 99.98,63.52 33.02,63.52 31.98,62.48 OUT-3.A
N$61
  Top 0.2: OUT-4.A 42.1,62.6 42.63,63.13 99.81,63.13 102.49,60.45 R26.8
N$62
  Top 0.2: R27.5 104.6,57.79 99.65,62.74 53.34,62.74 52.22,61.62 OUT-5.A
N$63
  Top 0.2: R27.6 104.85,56.99 99.49,62.35 63.99,62.35 OUT-6.A
N$64
  Top 0.2: R27.7 105.1,56.19 99.33,61.96 98.2,61.96 98,61.96 73.72,61.96 OUT-7.A
N$65
  Top 0.2: R27.8 105.35,55.39 99.17,61.57 83.44,61.57 OUT-8.A
N$66
  Top 0.2: FAULT.A 122.14,47.98 122.14,52.48 R29.2
N$67
  Top 0.2: R28.2 122.74,53.96 123.3,53.4 123.3,40.14 ETH.A
N$68
  Top 0.2: R30.2 122.66,55.34 123.7,54.3 123.7,31.54 PWR.A

### Text on the board
tPlace: Display Board REV2.0
bPlace: github.com/DvidMakesThings/HW_10-In-Rack_PDU
bNames: o